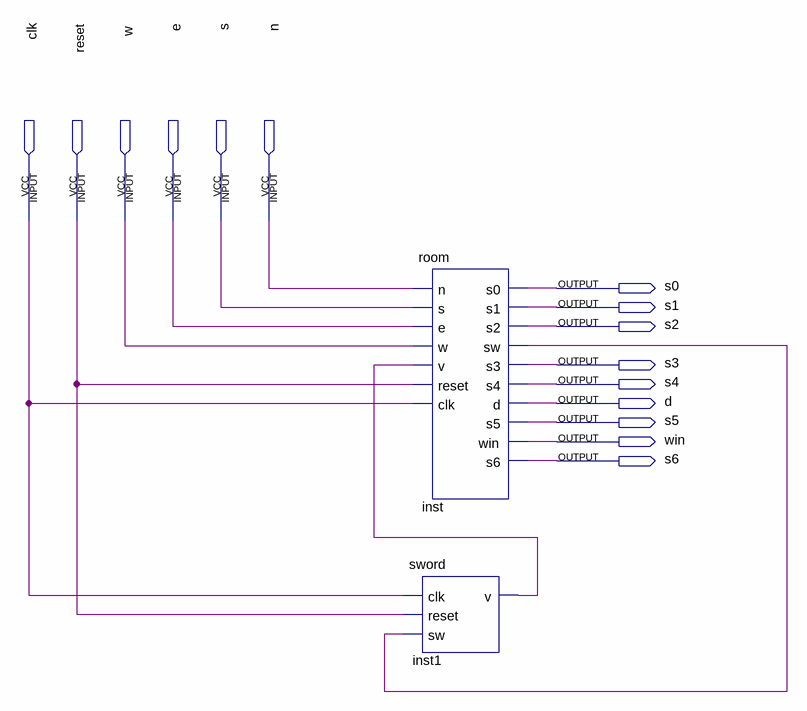
[diagram p0: schematic sheet]
// Quartus schematic project03_al.bdf as structural Verilog: 2 symbols, 15 pins
module project03_al (
  input  clk,
  input  reset,
  input  w,
  input  e,
  input  s,
  input  n,
  output s0,
  output s1,
  output s2,
  output s3,
  output s4,
  output d,
  output s5,
  output win,
  output s6
);

  wire inst1_v, inst_sw;

  room inst (
    .n(n), .s(s), .e(e), .w(w), .v(inst1_v), .reset(reset), .clk(clk), .s0(s0), .s1(s1), .s2(s2),
    .sw(inst_sw), .s3(s3), .s4(s4), .d(d), .s5(s5), .win(win), .s6(s6));
  sword inst1 (.clk(clk), .reset(reset), .sw(inst_sw), .v(inst1_v));
endmodule
